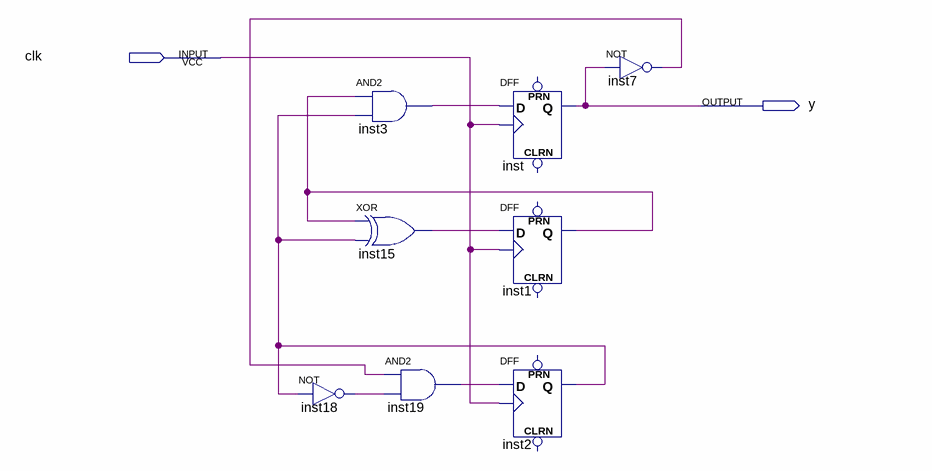
[diagram p0: schematic sheet]
// Quartus schematic 5Xdec.bdf as structural Verilog: 8 symbols, 2 pins
module \5Xdec  (
  input  clk,
  output y
);

  wire inst1_q, inst2_q, inst3_out, inst7_out, inst15_out, inst18_out, inst19_out;

  not inst18 (inst18_out, inst2_q);
  and inst3 (inst3_out, inst1_q, inst2_q);
  xor inst15 (inst15_out, inst1_q, inst2_q);
  and inst19 (inst19_out, inst7_out, inst18_out);
  DFF inst (.CLK(clk), .D(inst3_out), .Q(y));  // open: CLRN, PRN
  DFF inst1 (.CLK(clk), .D(inst15_out), .Q(inst1_q));  // open: CLRN, PRN
  DFF inst2 (.CLK(clk), .D(inst19_out), .Q(inst2_q));  // open: CLRN, PRN
  not inst7 (inst7_out, y);
endmodule
